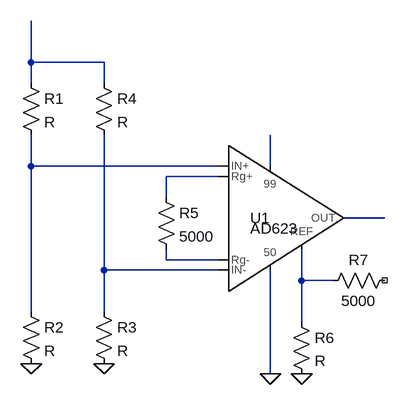
[diagram p0: schematic ANALOG.asc]
ANALOG.asc, the LTspice schematic file:
Version 4
SHEET 1 880 680
WIRE 64 -160 64 -224
WIRE 176 -160 64 -160
WIRE 64 -128 64 -160
WIRE 176 -128 176 -160
WIRE 64 0 64 -48
WIRE 352 0 64 0
WIRE 432 0 432 -48
WIRE 352 16 272 16
WIRE 272 48 272 16
WIRE 608 80 544 80
WIRE 272 144 272 128
WIRE 352 144 272 144
WIRE 176 160 176 -48
WIRE 352 160 176 160
WIRE 480 176 480 128
WIRE 528 176 480 176
WIRE 64 224 64 0
WIRE 176 224 176 160
WIRE 480 240 480 176
WIRE 432 320 432 160
FLAG 480 320 0
FLAG 432 320 0
FLAG 176 304 0
FLAG 64 304 0
SYMBOL res 48 -144 R0
SYMATTR InstName R1
SYMBOL res 48 208 R0
SYMATTR InstName R2
SYMBOL res 160 208 R0
SYMATTR InstName R3
SYMBOL res 160 -144 R0
SYMATTR InstName R4
SYMBOL res 256 32 R0
SYMATTR InstName R5
SYMATTR Value 5000
SYMBOL res 464 224 R0
SYMATTR InstName R6
SYMBOL res 624 160 R90
WINDOW 0 0 56 VBottom 2
WINDOW 3 32 56 VTop 2
SYMATTR InstName R7
SYMATTR Value 5000
SYMBOL ad623 368 80 R0
SYMATTR InstName U1

The netlist it stands for:
* ANALOG.asc
R1 N001 N002 R
R2 N002 0 R
R3 N007 0 R
R4 N001 N007 R
R5 N004 N006 5000
R6 N008 0 R
R7 NC_01 N008 5000
XU1 N002 N007 N004 N006 N003 0 N005 N008 AD623  ; pins IN+ IN- Rg+ Rg- 99 50 OUT REF
.lib ad623.cir
.backanno
.end